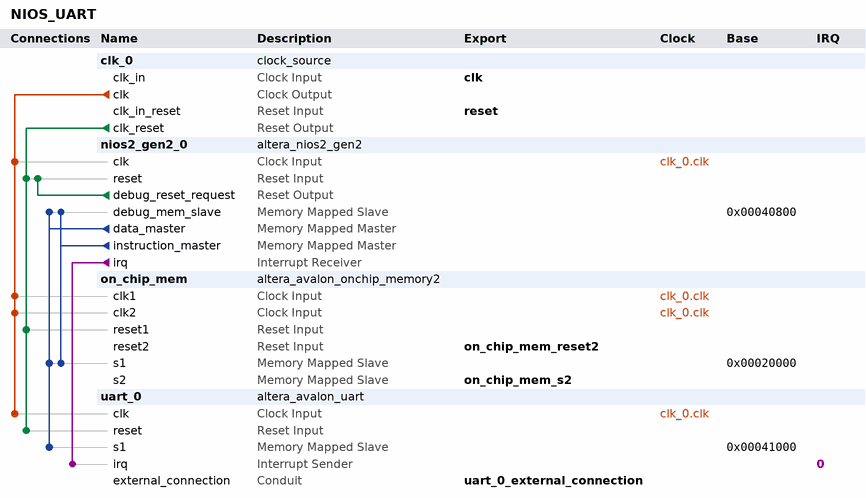
[diagram p0: system contents]
# Platform Designer (Qsys) system NIOS_UART, Cyclone V 5CSEMA5F31C6
# Parameters at their usual value, and those the tool derives, are not listed.
package require -exact qsys 22.1
create_system NIOS_UART
set_project_property DEVICE_FAMILY {Cyclone V}
set_project_property DEVICE 5CSEMA5F31C6

add_instance clk_0 clock_source 22.1
set_instance_parameter_value clk_0 clockFrequency 50000000

add_instance nios2_gen2_0 altera_nios2_gen2 22.1
set_instance_parameter_value nios2_gen2_0 dcache_size 2048
set_instance_parameter_value nios2_gen2_0 exceptionSlave on_chip_mem.s1
set_instance_parameter_value nios2_gen2_0 icache_size 4096
set_instance_parameter_value nios2_gen2_0 impl Tiny
set_instance_parameter_value nios2_gen2_0 resetSlave on_chip_mem.s1

add_instance on_chip_mem altera_avalon_onchip_memory2 22.1
set_instance_parameter_value on_chip_mem dataWidth 32
set_instance_parameter_value on_chip_mem dualPort true
set_instance_parameter_value on_chip_mem enableDiffWidth true
set_instance_parameter_value on_chip_mem initMemContent true
set_instance_parameter_value on_chip_mem initializationFileName rtl/mem_prob/P_1_8.hex
set_instance_parameter_value on_chip_mem memorySize 71680
set_instance_parameter_value on_chip_mem useNonDefaultInitFile true

add_instance uart_0 altera_avalon_uart 22.1
set_instance_parameter_value uart_0 baud 115200
set_instance_parameter_value uart_0 dataBits 8
set_instance_parameter_value uart_0 fixedBaud true
set_instance_parameter_value uart_0 parity NONE
set_instance_parameter_value uart_0 stopBits 1

# connections
add_connection clk_0.clk nios2_gen2_0.clk clock
add_connection clk_0.clk on_chip_mem.clk1 clock
add_connection clk_0.clk on_chip_mem.clk2 clock
add_connection clk_0.clk uart_0.clk clock
add_connection clk_0.clk_reset nios2_gen2_0.reset reset
add_connection clk_0.clk_reset on_chip_mem.reset1 reset
add_connection clk_0.clk_reset uart_0.reset reset
add_connection nios2_gen2_0.debug_reset_request nios2_gen2_0.reset reset
add_connection nios2_gen2_0.data_master nios2_gen2_0.debug_mem_slave avalon
set_connection_parameter_value nios2_gen2_0.data_master/nios2_gen2_0.debug_mem_slave baseAddress 0x00040800
add_connection nios2_gen2_0.data_master on_chip_mem.s1 avalon
set_connection_parameter_value nios2_gen2_0.data_master/on_chip_mem.s1 baseAddress 0x00020000
add_connection nios2_gen2_0.data_master uart_0.s1 avalon
set_connection_parameter_value nios2_gen2_0.data_master/uart_0.s1 baseAddress 0x00041000
add_connection nios2_gen2_0.instruction_master nios2_gen2_0.debug_mem_slave avalon
set_connection_parameter_value nios2_gen2_0.instruction_master/nios2_gen2_0.debug_mem_slave baseAddress 0x00040800
add_connection nios2_gen2_0.instruction_master on_chip_mem.s1 avalon
set_connection_parameter_value nios2_gen2_0.instruction_master/on_chip_mem.s1 baseAddress 0x00020000
add_connection nios2_gen2_0.irq uart_0.irq interrupt
set_connection_parameter_value nios2_gen2_0.irq/uart_0.irq irqNumber 0

# exported interfaces
add_interface clk clock sink
set_interface_property clk EXPORT_OF clk_0.clk_in
add_interface on_chip_mem_reset2 reset sink
set_interface_property on_chip_mem_reset2 EXPORT_OF on_chip_mem.reset2
add_interface on_chip_mem_s2 avalon slave
set_interface_property on_chip_mem_s2 EXPORT_OF on_chip_mem.s2
add_interface reset reset sink
set_interface_property reset EXPORT_OF clk_0.clk_in_reset
add_interface uart_0_external_connection conduit end
set_interface_property uart_0_external_connection EXPORT_OF uart_0.external_connection

set_interconnect_requirement {$system} qsys_mm.clockCrossingAdapter HANDSHAKE
set_interconnect_requirement {$system} qsys_mm.enableEccProtection FALSE
set_interconnect_requirement {$system} qsys_mm.insertDefaultSlave FALSE
set_interconnect_requirement {$system} qsys_mm.maxAdditionalLatency 1

save_system NIOS_UART.qsys
